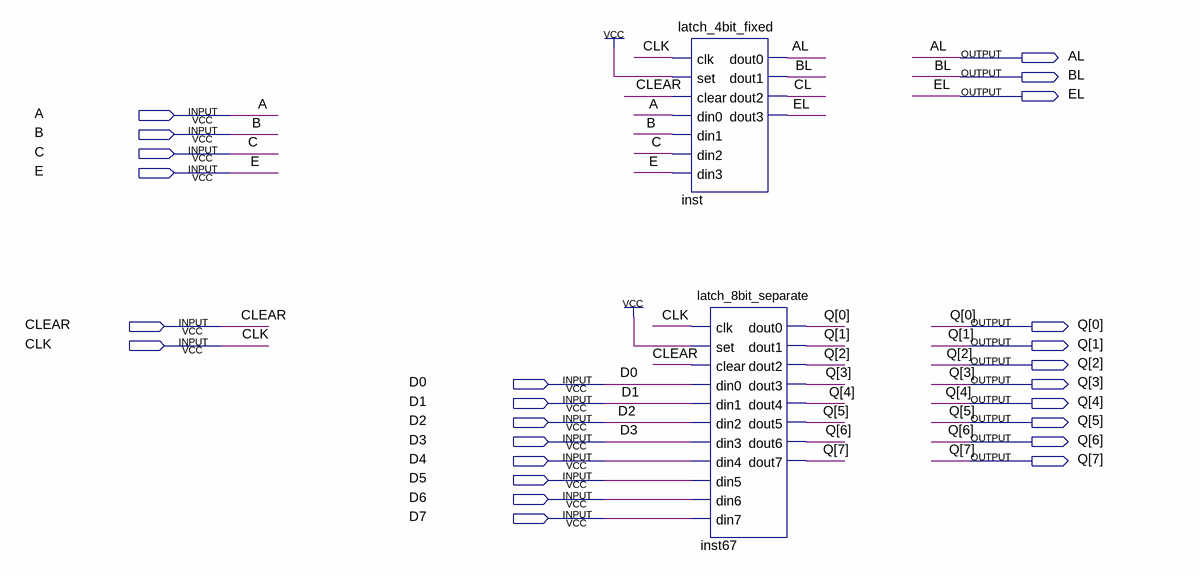
[diagram p0: schematic sheet]
// Quartus schematic latch_test01.bdf as structural Verilog: 2 symbols, 25 pins
module latch_test01 (
  input  A,
  input  B,
  input  C,
  input  E,
  input  CLEAR,
  input  CLK,
  input  D0,
  input  D1,
  input  D2,
  input  D3,
  input  D4,
  input  D5,
  input  D6,
  input  D7,
  output AL,
  output BL,
  output EL,
  output [7:0] Q
);

  wire CL;

  latch_4bit_fixed inst (
    .clk(CLK), .set(1'b1), .clear(CLEAR), .din0(A), .din1(B), .din2(C), .din3(E), .dout0(AL), .dout1(BL),
    .dout2(CL), .dout3(EL));
  latch_8bit_separate inst67 (
    .clk(CLK), .set(1'b1), .clear(CLEAR), .din0(D0), .din1(D1), .din2(D2), .din3(D3), .din4(D4), .din5(D5),
    .din6(D6), .din7(D7), .dout0(Q[0]), .dout1(Q[1]), .dout2(Q[2]), .dout3(Q[3]), .dout4(Q[4]), .dout5(Q[5]),
    .dout6(Q[6]), .dout7(Q[7]));
endmodule
